# EAGLE schematic 1-3 (EAGLE 9.6.2)
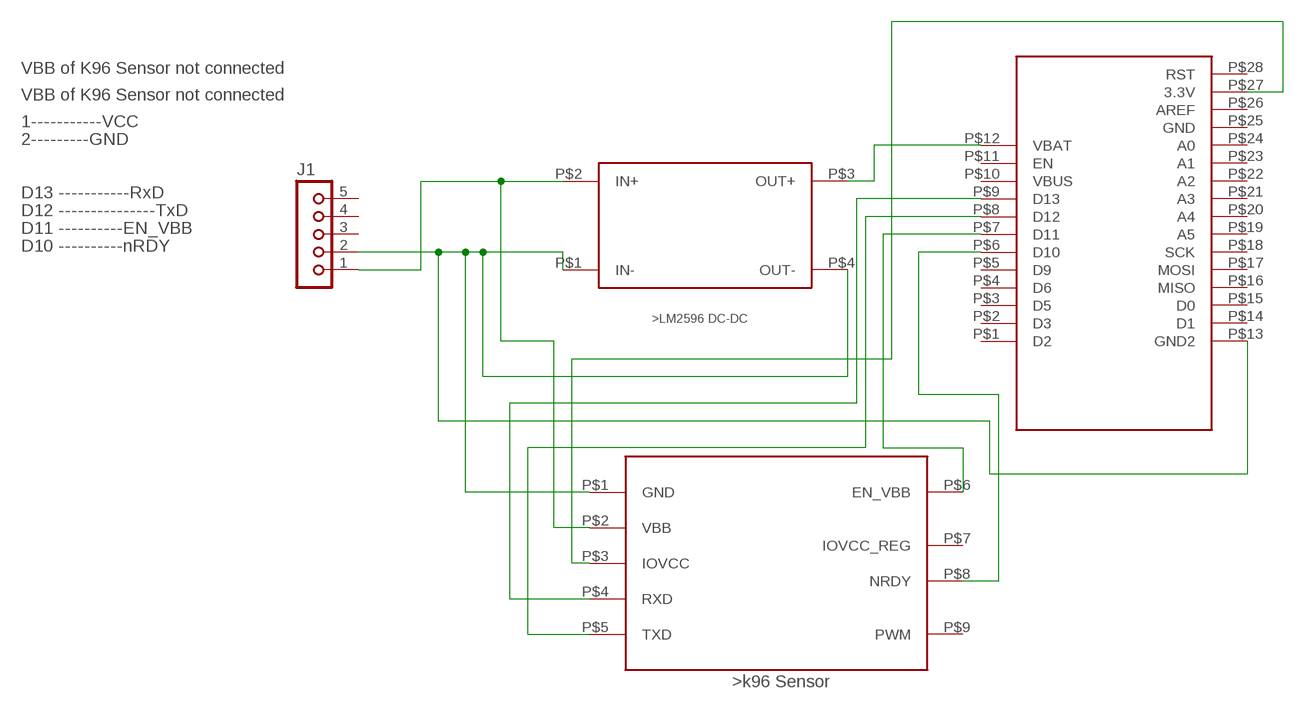
[diagram p0: schematic, sheet 1]

## Parts
DCDC1  DCDC  [DCDC]
FEATHER1  FEATHER  [FEATHER]
J1  JU05  [JU05]
K96SENSOR1  K96SENSOR  [K96SENSOR]

## Nets
N$1: DCDC1.P$2(IN+) J1.1 K96SENSOR1.P$2(VBB)
N$2: DCDC1.P$1(IN-) DCDC1.P$4(OUT-) FEATHER1.P$13(GND2) J1.2 K96SENSOR1.P$1(GND)
N$3: FEATHER1.P$6(D10) K96SENSOR1.P$8(NRDY)
N$4: DCDC1.P$3(OUT+) FEATHER1.P$12(VBAT)
N$5: FEATHER1.P$9(D13) K96SENSOR1.P$4(RXD)
N$6: FEATHER1.P$8(D12) K96SENSOR1.P$5(TXD)
N$7: FEATHER1.P$7(D11) K96SENSOR1.P$6(EN_VBB)
N$9: FEATHER1.P$27(3.3V) K96SENSOR1.P$3(IOVCC)
Unconnected: FEATHER1.P$1(D2) FEATHER1.P$2(D3) FEATHER1.P$3(D5) FEATHER1.P$4(D6) FEATHER1.P$5(D9) FEATHER1.P$10(VBUS) FEATHER1.P$11(EN) FEATHER1.P$14(D1) FEATHER1.P$15(D0) FEATHER1.P$16(MISO) FEATHER1.P$17(MOSI) FEATHER1.P$18(SCK) FEATHER1.P$19(A5) FEATHER1.P$20(A4) FEATHER1.P$21(A3) FEATHER1.P$22(A2) FEATHER1.P$23(A1) FEATHER1.P$24(A0) FEATHER1.P$25(GND) FEATHER1.P$26(AREF) FEATHER1.P$28(RST) J1.3 J1.4 J1.5 K96SENSOR1.P$7(IOVCC_REG) K96SENSOR1.P$9(PWM)

## Notes on the sheet
- VBB of K96 Sensor not connected
- VBB of K96 Sensor not connected
- 1-----------VCC
- 2---------GND
- D13 -----------RxD
- D12 ---------------TxD
- D11 ----------EN_VBB
- D10 ----------nRDY

## Library data of the parts
DCDC1 = untitled:DCDC
FEATHER1 = untitled:FEATHER
J1 = con-lsta:JU05: PIN HEADER; OC_FARNELL: unknown; OC_NEWARK: unknown
K96SENSOR1 = untitled:K96SENSOR